# EAGLE design ss-test (EAGLE 7.5.0)
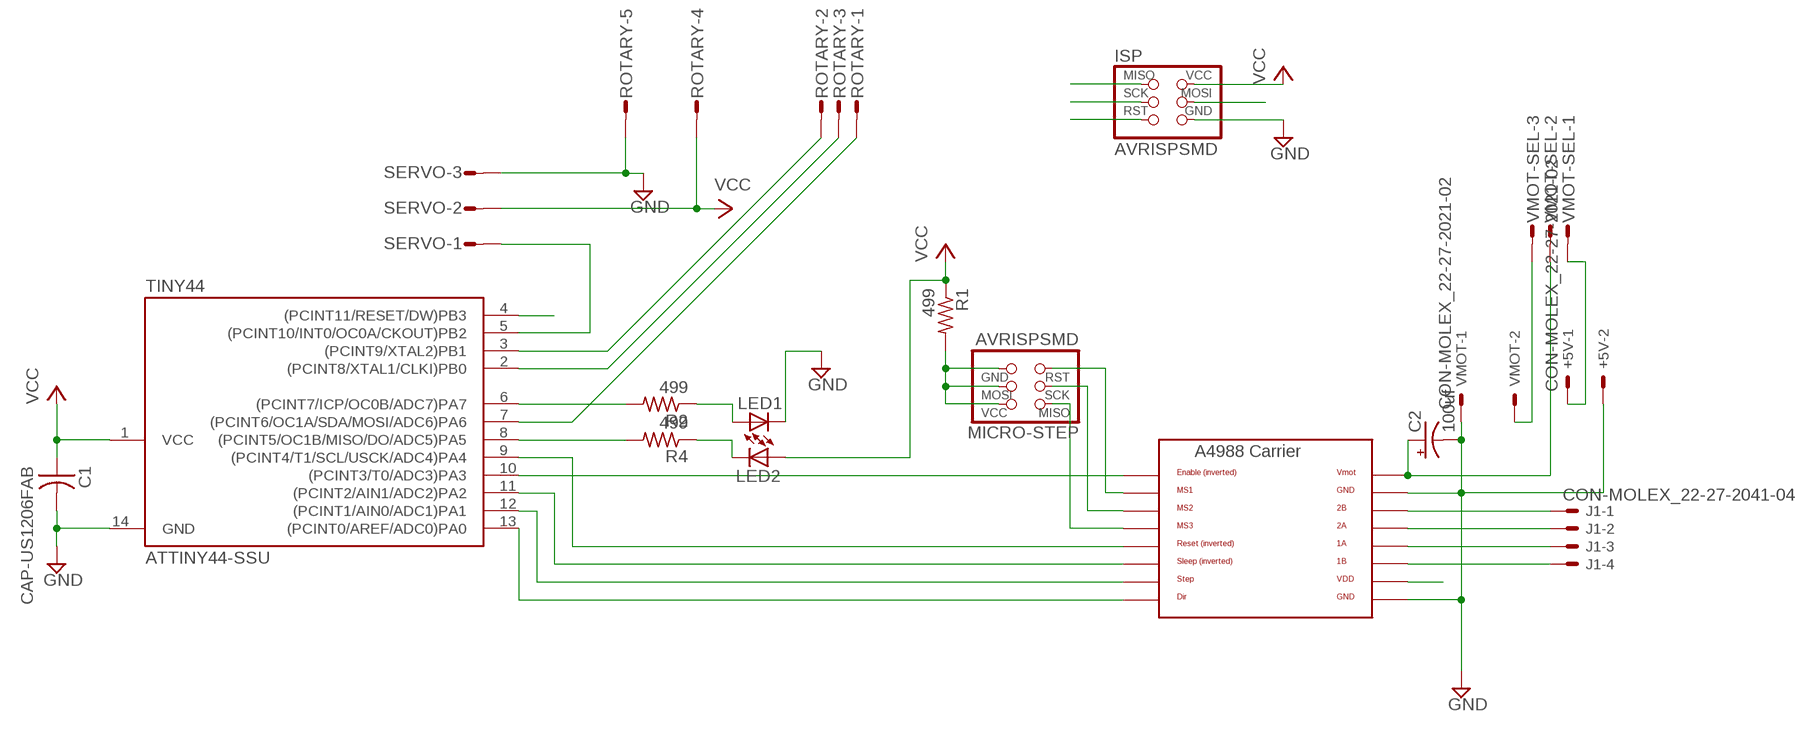
[diagram p0: schematic, sheet 1]

## Parts
+5V  CON-MOLEX_22-27-2021-02  [CON-MOLEX_6410-02]
A4988  REPRAPJR_A4988BREAKOUT  [REPRAPJR_A4988BREAKOUT]
C1  CAP-US1206FAB  [C1206FAB]
C2  100uf  RCL_CPOL-US140CLH-0810  [RCL_140CLH-0810]
ISP  AVRISPSMD  [2X03SMD]
J1  CON-MOLEX_22-27-2041-04  [CON-MOLEX_6410-04]
LED1  LED_LEDSML1206  [LED_SML1206]
LED2  LED_LEDSML1206  [LED_SML1206]
MICRO-STEP  AVRISPSMD  [2X03SMD]
R1  499  RES-US1206FAB  [R1206FAB]
R2  499  RES-US1206FAB  [R1206FAB]
R4  499  RES-US1206FAB  [R1206FAB]
ROTARY  S05P  [S05P]
SERVO  S03P  [S03P]
TINY44  ATTINY44-SSU  [SOIC14]
VMOT  CON-MOLEX_22-27-2021-02  [CON-MOLEX_6410-02]
VMOT-SEL  S03P  [S03P]

## Nets
GND: +5V.2 A4988.GND A4988.GND@0(GND) C1.2 C2.- ISP.6(GND) LED1.C ROTARY.5 SERVO.3 TINY44.14(GND) VMOT.1
MISO: ISP.1(MISO) R4.2 TINY44.8((PCINT5/OC1B/MISO/DO/ADC5)PA5)
MOSI: ISP.4(MOSI) ROTARY.1 TINY44.7((PCINT6/OC1A/SDA/MOSI/ADC6)PA6)
N$1: A4988.2B J1.1
N$2: A4988.2A J1.2
N$3: A4988.1A J1.3
N$4: A4988.1B J1.4
N$5: A4988.MS1 MICRO-STEP.5(RST)
N$6: A4988.MS2 MICRO-STEP.3(SCK)
N$7: A4988.MS3 MICRO-STEP.1(MISO)
N$8: ROTARY.2 TINY44.3((PCINT9/XTAL2)PB1)
N$9: ROTARY.3 TINY44.2((PCINT8/XTAL1/CLKI)PB0)
N$10: A4988.DIR TINY44.13((PCINT0/AREF/ADC0)PA0)
N$11: A4988.STEP TINY44.12((PCINT1/AIN0/ADC1)PA1)
N$12: A4988.SLP(SLEEP) TINY44.11((PCINT2/AIN1/ADC2)PA2)
N$13: A4988.RST TINY44.10((PCINT3/T0/ADC3)PA3)
N$14: LED2.C R4.1
N$15: A4988.VMOT C2.+ VMOT-SEL.2
N$16: SERVO.1 TINY44.5((PCINT10/INT0/OC0A/CKOUT)PB2)
N$17: MICRO-STEP.2(VCC) MICRO-STEP.4(MOSI) MICRO-STEP.6(GND) R1.2
N$18: VMOT-SEL.3 VMOT.2
N$19: R2.2 TINY44.6((PCINT7/ICP/OC0B/ADC7)PA7)
N$20: LED1.A R2.1
RST: ISP.5(RST) TINY44.4((PCINT11/RESET/DW)PB3)
SCK: A4988.EN ISP.3(SCK) TINY44.9((PCINT4/T1/SCL/USCK/ADC4)PA4)
VCC: +5V.1 A4988.VDD C1.1 ISP.2(VCC) LED2.A R1.1 ROTARY.4 SERVO.2 TINY44.1(VCC) VMOT-SEL.1

## Library data of the parts
+5V VMOT = fork0.1:CON-MOLEX_22-?-02: CONNECTOR wire to board 2.54 mm (.1 inch) pitch header; OC_FARNELL: unknown; OC_NEWARK: unknown
A4988 = fork0.1:REPRAPJR_A4988BREAKOUT
C1 = fab:CAP-US
C2 = fork0.1:RCL_CPOL-US: POLARIZED CAPACITOR, American symbol
ISP MICRO-STEP = fab:AVRISP
J1 = fork0.1:CON-MOLEX_22-?-04: CONNECTOR wire to board 2.54 mm (.1 inch) pitch header; OC_FARNELL: unknown; OC_NEWARK: unknown
LED1 LED2 = fork0.1:LED_LED: LED OSRAM: - CHIPLED LG R971, LG N971, LY N971, LG Q971, LY Q971, LO R971, LY R971 LH N974, LH R974 LS Q976, LO Q976, LY Q976 LO Q996 - Hyper CHIPLED LW Q18S LB Q993, LB Q99A, LB R99A - SideLED LS A670, LO A670, LY A670, LG A670, LP A670 LB A673, LV A673, LT A673, LW A673 LH A674 LY A675 LS A676, LA A676, LO A676, LY A676, LW A676 LS A679, LY A679, LG A679 - Hyper Micro SIDELED® LS Y876, LA Y876, LO Y876, LY Y876 LT Y87S - SmartLED LW L88C, LW L88S LB L89C, LB L89S, LG L890 LS L89K, LO L89K, LY L89K LS L896, LA L896, LO L896, LY L896 - TOPLED LS T670, LO T670, LY T670, LG T670, LP T670 LSG T670, LSP T670, LSY T670, LOP T670, LYG T670 LG T671, LOG T671, LSG T671 LB T673, LV T673, LT T673, LW T673 LH T674 LS T676, LA T676, LO T676, LY T676, LB T676, LH T676, LSB T676, LW T676 LB T67C, LV T67C, LT T67C, LS T67K, LO T67K, LY T67K, LW E67C LS E67B, LA E67B, LO E67B, LY E67B, LB E67C, LV E67C, LT E67C LW T67C LS T679, LY T679, LG T679 LS T770, LO T770, LY T770, LG T770, LP T770 LB T773, LV T773, LT T773, LW T773 LH T774 LS E675, LA E675, LY E675, LS T675 LS T776, LA T776, LO T776, LY T776, LB T776 LHGB T686 LT T68C, LB T68C - Hyper Mini TOPLED® LB M676 - Mini TOPLED Santana® LG M470 LS M47K, LO M47K, LY M47K Source: http://www.osram.convergy.de LUXEON: - LUMILED® LXK2-PW12-R00, LXK2-PW12-S00, LXK2-PW14-U00, LXK2-PW14-V00 LXK2-PM12-R00, LXK2-PM12-S00, LXK2-PM14-U00 LXK2-PE12-Q00, LXK2-PE12-R00, LXK2-PE12-S00, LXK2-PE14-T00, LXK2-PE14-U00 LXK2-PB12-K00, LXK2-PB12-L00, LXK2-PB12-M00, LXK2-PB14-N00, LXK2-PB14-P00, LXK2-PB14-Q00 LXK2-PR12-L00, LXK2-PR12-M00, LXK2-PR14-Q00, LXK2-PR14-R00 LXK2-PD12-Q00, LXK2-PD12-R00, LXK2-PD12-S00 LXK2-PH12-R00, LXK2-PH12-S00 LXK2-PL12-P00, LXK2-PL12-Q00, LXK2-PL12-R00 Source: www.luxeon.com KINGBRIGHT: KA-3528ASYC Source: www.kingbright.com
R1 R2 R4 = fab:RES-US: Resistor (US Symbol) Variants with postfix FAB are widened to allow the routing of internal traces
ROTARY = con-amp-mt:S05P: AMP MT CONNECTOR; OC_FARNELL: unknown; OC_NEWARK: unknown
SERVO VMOT-SEL = con-amp-mt:S03P: AMP MT CONNECTOR; OC_FARNELL: unknown; OC_NEWARK: unknown
TINY44 = fab:ATTINY44

## Board
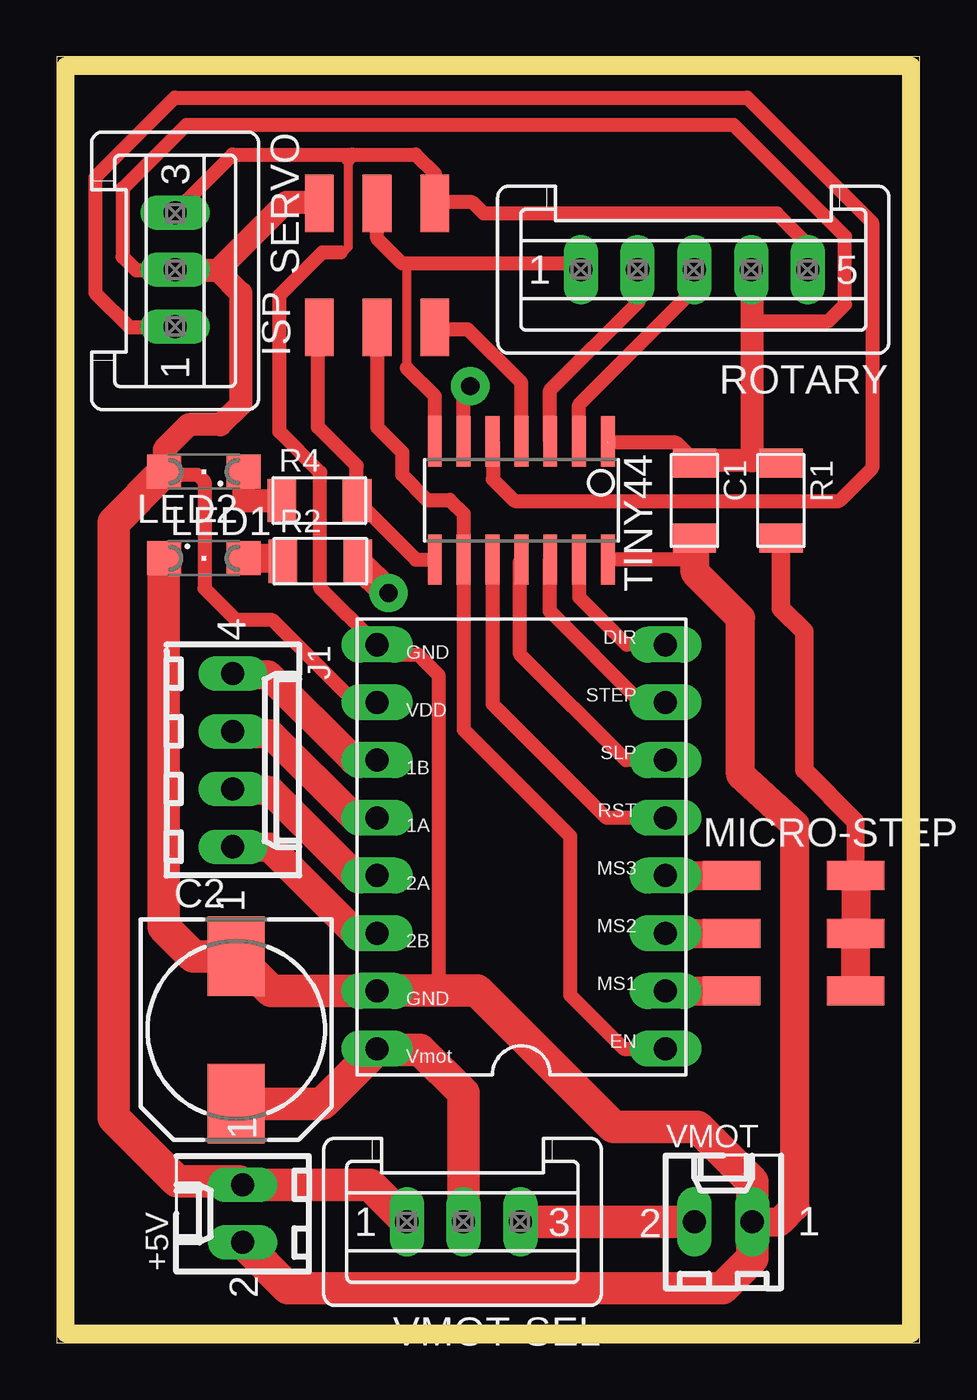
[diagram p1: board, top side]
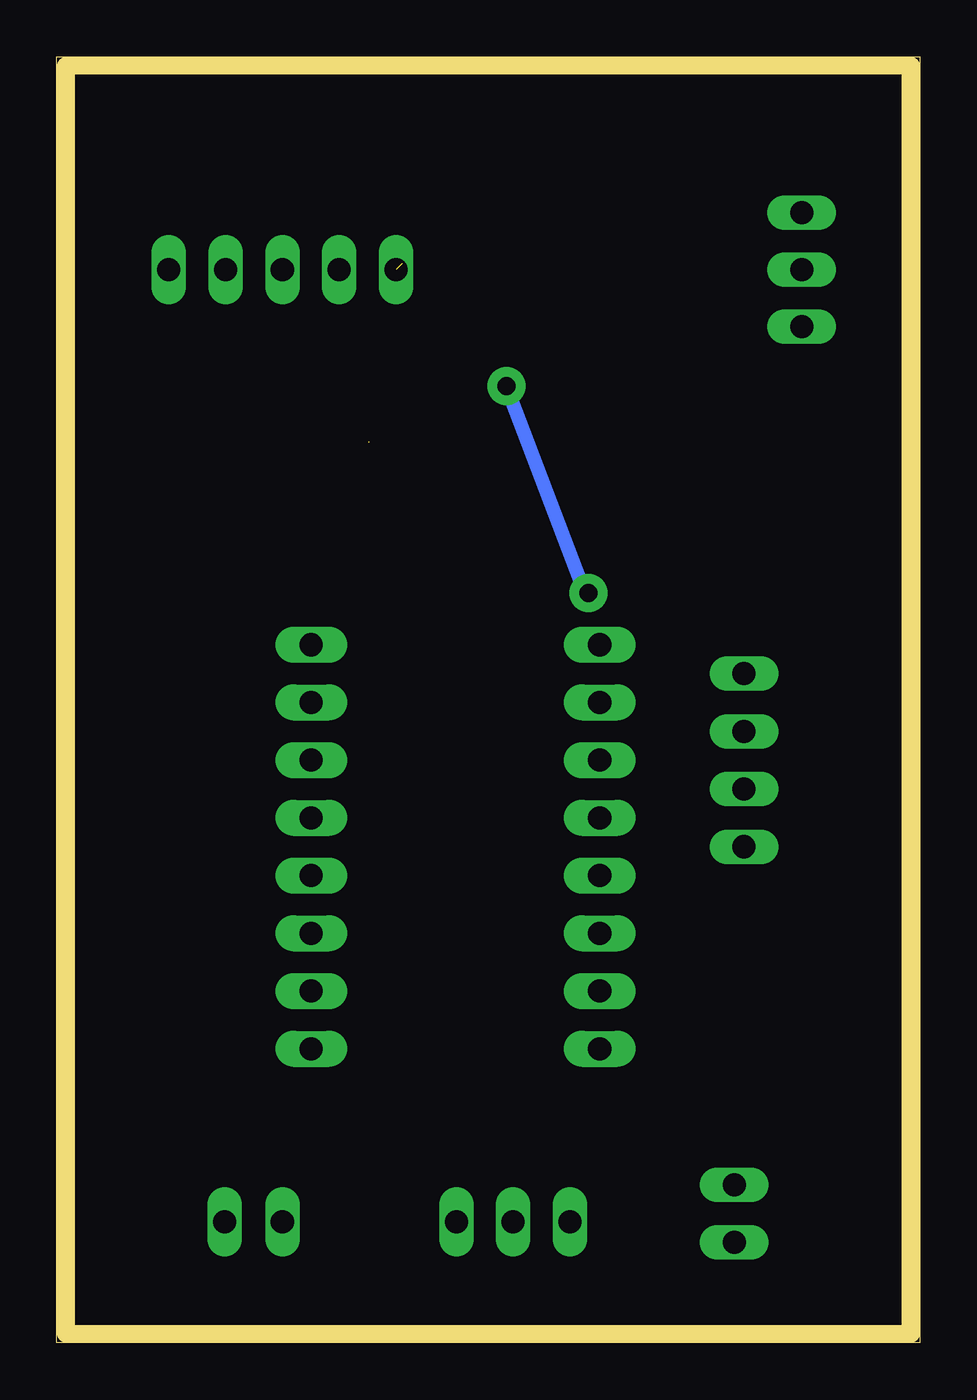
[diagram p2: board, bottom side, seen from below]

Size 38 x 56.6 mm. Coordinates in mm from the lower left corner, seen from the top.
Outline: 0,0 38,0 38,56.6 0,56.6 0,0
Copper layers (1*16): Top 0.035mm / dielectric 1.5mm / Bottom 0.035mm
Design rules "default *": minimum track width 0.4mm, minimum drill 0.8mm, track to track 0.4mm, track to pad 0.4mm, pad to pad 0.4mm, via to via 0.4mm, smd to smd 0mil, copper to edge 40mil, drill to drill 8mil, minimum pad ring 10mil, minimum via ring 8mil, stop-mask expansion 4mil, vias tented up to drill 0mil, thermal gap 10mil
Milling: 4 lines

### Footprints (pad centres in the part's own frame; a part is rotated, then mirrored left to right if it is on the bottom)
CON-MOLEX_6410-02 = drill 1.016 long: 1 1.27,0; 2 -1.27,0
REPRAPJR_A4988BREAKOUT = drill 1.016 pad 1.575 long: 1A 8.89,1.27; 1B 11.43,1.27; 2A 6.35,1.27; 2B 3.81,1.27; DIR 16.51,-11.43; EN -1.27,-11.43; GND 16.51,1.27; GND@0 1.27,1.27; MS1 1.27,-11.43; MS2 3.81,-11.43; MS3 6.35,-11.43; RST 8.89,-11.43; SLP 11.43,-11.43; STEP 13.97,-11.43; VDD 13.97,1.27; VMOT -1.27,1.27
C1206FAB = smd 1.27 x 1.905: 1 -1.651,0; 2 1.651,0
RCL_140CLH-0810 = smd 3.5 x 2.5: + 3.25,0; - -3.25,0
2X03SMD = smd 2.54 x 1.27: 1 -2.54,2.54; 2 2.92,2.54; 3 -2.54,0; 4 2.92,0; 5 -2.54,-2.54; 6 2.92,-2.54
CON-MOLEX_6410-04 = drill 1.016 long: 1 3.81,0; 2 1.27,0; 3 -1.27,0; 4 -3.81,0
LED_SML1206 = smd 1.5 x 1.5: A 1.75,0; C -1.75,0
R1206FAB = smd 1.27 x 1.905: 1 -1.651,0; 2 1.651,0
S05P = drill 1.016 long: 1 5,0; 2 2.5,0; 3 0,0; 4 -2.5,0; 5 -5,0
S03P = drill 1.016 long: 1 2.5,0; 2 0,0; 3 -2.5,0
SOIC14 = smd 0.61 x 2.21: 1 -3.81,-2.603; 2 -2.54,-2.603; 3 -1.27,-2.603; 4 0,-2.603; 5 1.27,-2.603; 6 2.54,-2.603; 7 3.81,-2.603; 8 3.81,2.603; 9 2.54,2.603; 10 1.27,2.603; 11 0,2.603; 12 -1.27,2.603; 13 -2.54,2.603; 14 -3.81,2.603

### Placement (x,y rotation side)
+5V  8.18,5.68 90 top
A4988  15.37,14.21 90 top
C1  28.07,37.07 270 top
C2  7.9,13.77 270 top
ISP  14.1,47.23 90 top
J1  7.75,25.64 270 top
LED1  6.48,34.53 0 top
LED2  6.48,38.34 180 top
MICRO-STEP  32.25,18.02 0 top
R1  31.88,37.07 270 top
R2  11.6,34.4 0 top
R4  11.56,37.07 0 top
ROTARY  28.07,47.23 180 top
SERVO  5.21,47.23 270 top
TINY44  20.45,37.07 180 top
VMOT  29.34,5.32 0 top
VMOT-SEL  17.91,5.32 180 top

### Tracks (layer width: path | path; a pad name or v marks a point on that pad's centre or on a via)
GND
  Top 0.406: 12,48 12.5,48 12.6,48 12.83,48.23 12.83,52.09 | ISP.6 16.69,50.1
  Top 0.61: C1.2 28.07,34.47 TINY44.14 | 16.8,15.5 16.8,29.4 15.9,30.3 14.52,30.3 A4988.GND 11.6,33.22 11.6,38.3 9.8,40.1 9.8,46.1 11.7,48 12.5,48 | ROTARY.5 33.07,48.33 31.7,49.7 18.8,49.7 18.3,50.2 16.69,50.2 ISP.6 16.64,51.46 15.8,52.3 13,52.3 | 13,52.3 7.74,52.3 5.21,49.77 SERVO.3 | 30.61,5.28 30.61,5.21 30.6,5.2 30.6,5.3 VMOT.1 | 12.83,52.09 12.83,52.13 13,52.3
  Top 1.016: 30.63,5.3 VMOT.1
  Top 1.27: 30.63,5.3 31.8,5.3 32.5,6 32.5,22.8 30.1,25 30.1,31.9 28.1,33.9 28.1,35.39 C1.2
  Top 1.422: +5V.2 10.19,2.4 29.3,2.4 30.61,3.71 30.61,5.28 VMOT.1 30.61,7.09 28.2,9.5 24.5,9.5 18.5,15.5 16.8,15.5 14.12,15.5 A4988.GND@0 9.44,15.48 C2.- 7.88,17 6,17 4.7,18.3 4.7,34.53 LED1.C
MISO
  Top 0.406: 13.2,37.08 R4.2
  Top 0.61: TINY44.8 15.81,34.47 13.2,37.08 13.2,38.6 11.5,40.3 11.5,44.63 ISP.1
MOSI  (1 unrouted)
  Top 0.406: 14.1,50.09 14.11,50.09 14.11,50.14 ISP.4 | 15.4,47.5 15.4,42.9
  Top 0.61: TINY44.7 16.64,41.66 15.4,42.9 | 22.8,47.5 15.4,47.5 15.2,47.5 14.1,48.6 ISP.4
N$1
  Top 1.27: A4988.2B 13.18,18.02 9.4,21.8 7.78,21.8 J1.1
N$2
  Top 1.27: A4988.2A 13.14,20.56 9.4,24.3 7.82,24.3 J1.2
N$3
  Top 1.27: A4988.1A 13.1,23.1 9.4,26.8 7.86,26.8 J1.3
N$4
  Top 1.27: A4988.1B 13.06,25.64 9.3,29.4 7.8,29.4 J1.4
N$5
  Top 1.27: A4988.MS1 MICRO-STEP.5
N$6
  Top 1.27: A4988.MS2 MICRO-STEP.3
N$7
  Top 1.27: A4988.MS3 MICRO-STEP.1
N$8
  Top 0.61: TINY44.3 21.72,41.92 25.6,45.8 25.6,47.2 ROTARY.2
N$9
  Top 0.61: TINY44.2 22.99,41.29 28.1,46.4 28.1,47.2 ROTARY.3
N$10
  Top 0.61: A4988.DIR 25.08,30.72 23,32.8 23,34.46 TINY44.13
N$11
  Top 0.61: A4988.STEP 25.72,28.18 21.7,32.2 21.7,34.45 TINY44.12
N$12
  Top 0.61: A4988.SLP 25.06,25.64 20.4,30.3 20.4,34.42 TINY44.11
N$13
  Top 0.61: A4988.RST 24.2,23.1 19.2,28.1 19.2,34.45 TINY44.10
N$14
  Top 0.406: LED2.C
  Top 1.016: LED2.C 8.23,37.07 R4.1
N$15
  Top 1.422: VMOT-SEL.2 17.91,10.99 16,12.9 14.14,12.9 A4988.VMOT 11.68,10.52 C2.+
N$16
  Top 0.61: TINY44.5 19.2,39.65 19.2,38 20.15,37.05 34.45,37.05 35.9,38.5 35.9,49.3 30.4,54.8 5.2,54.8 1.7,51.3 1.7,46.2 3.2,44.7 5.18,44.7 SERVO.1
N$17
  Top 0.8: MICRO-STEP.2 35.17,22.93 32.9,25.2
  Top 0.813: R1.2 31.88,32.32 32.9,31.3 32.9,25.2
  Top 1.27: MICRO-STEP.6 MICRO-STEP.4 MICRO-STEP.2
N$18
  Top 1.422: VMOT-SEL.3 VMOT.2
N$19  (via drill 0.8 pad 1.68)
  Top 0.61: TINY44.6 17.91,41.81 v18.2,42.1
  Top 1.27: R2.2 13.25,34.35 v14.6,33
  Bottom 0.61: v18.2,42.1 14.7,32.9 v14.6,33
N$20
  Top 1.27: LED1.A 9.95,34.53 R2.1
RST
  Top 0.61: TINY44.4 20.45,42.25 18.1,44.6 16.73,44.6 ISP.5
SCK
  Top 0.61: ISP.3 14.1,40.3 15.2,39.2 15.2,38.2 16.3,37.1 17.3,37.1 17.91,36.49 TINY44.9 17.91,26.99 22.6,22.3 22.6,15.3 24.96,12.94 A4988.EN
VCC  (1 unrouted)
  Top 0.61: 24.26,39.61 27.28,39.61 28.07,38.82 C1.1 | 31.88,38.82 R1.1 | LED2.A 4.87,38.2 6.2,38.2 6.5,37.9 6.5,33.2 7.9,31.8 9.5,31.8 13.1,28.2 14.08,28.2 A4988.VDD | 30.61,44.97 33.97,44.97 34.7,45.7 34.7,48.7 29.8,53.6 5.7,53.6 2.9,50.8 2.9,47.8 3.5,47.2 5.18,47.2 SERVO.2 | 30.61,47.23 ROTARY.4
  Top 1.016: 31.88,38.82 30.61,38.82 | 30.61,38.82 28.07,38.82 | 30.61,38.82 30.61,44.97 30.61,47.23 | 7.1,47.2 10.1,50.2 11.51,50.2 ISP.2 | 5.18,47.2 7.1,47.2 | 7.1,47.2 8.1,46.2 8.1,41.3 7.2,40.4 5.8,40.4 4.73,39.33 LED2.A
  Top 1.422: LED2.A 2.5,36.11 2.5,9.9 5.3,7.1 8.03,7.1 +5V.1 13.78,6.95 VMOT-SEL.1